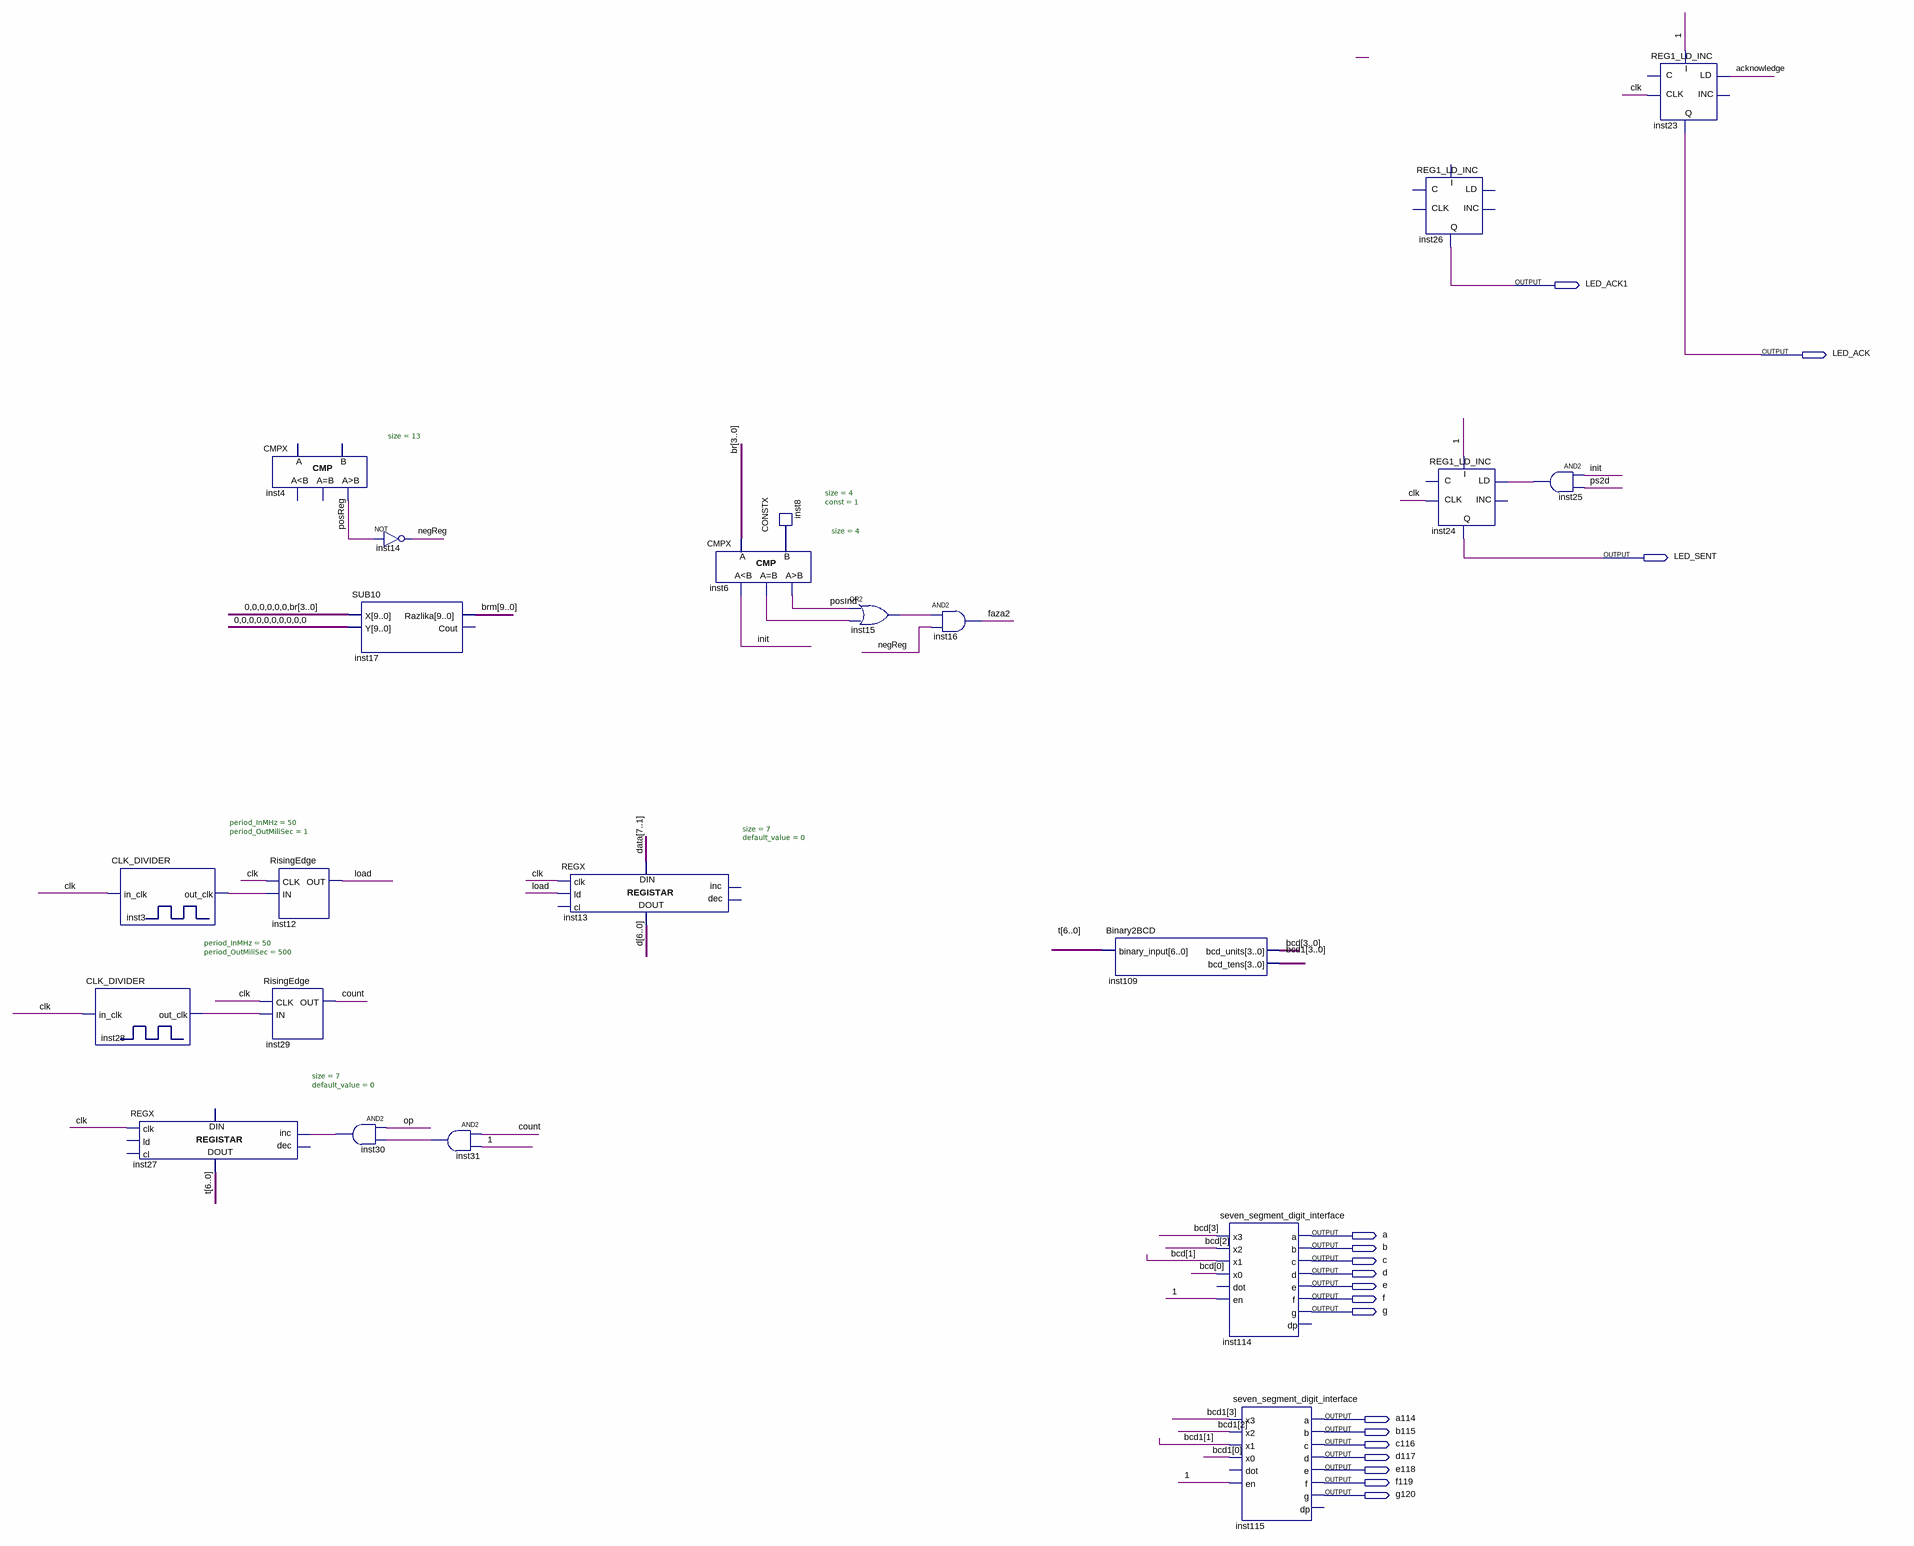
[diagram p0: schematic sheet]
// Quartus schematic MouseSetup - Copy.bdf as structural Verilog: 22 symbols, 17 pins
module \MouseSetup_-_Copy  (
  output LED_ACK1,
  output LED_ACK,
  output LED_SENT,
  output a,
  output b,
  output c,
  output d,
  output e,
  output f,
  output g,
  output a114,
  output b115,
  output c116,
  output d117,
  output e118,
  output f119,
  output g120
);

  wire \0 , \1 , acknowledge, clk, count, faza2, init, inst3_out_clk, inst6_eq, inst15_out, inst25_out,
       inst28_out_clk, inst30_out, inst31_out, load, negReg, op, posInd, posReg, ps2d;
  wire [3:0] bcd, bcd1, br, inst8_data;
  wire [6:0] d_bus, t;
  wire [7:1] data;
  wire [9:0] brm;

  CLK_DIVIDER #(.period_InMHz(50), .period_OutMiliSec(1)) inst3 (.in_clk(clk), .out_clk(inst3_out_clk));
  CLK_DIVIDER #(.period_InMHz(50), .period_OutMiliSec(500)) inst28 (.in_clk(clk), .out_clk(inst28_out_clk));
  REGX #(.size(7), .default_value(0)) inst27 (.clk(clk), .inc(inst30_out), .data_out(t));  // open: ld, cl, dec, data_in
  CMPX #(.size(13)) inst4 (.gr(posReg));  // open: A, B, ls, eq
  RisingEdge inst29 (.CLK(clk), .IN(inst28_out_clk), .OUT(count));
  RisingEdge inst12 (.CLK(clk), .IN(inst3_out_clk), .OUT(load));
  SUB10 inst17 (.X({{6{\0 }}, br}), .Y({10{\0 }}), .Razlika(brm));  // open: Cout
  and inst30 (inst30_out, op, inst31_out);
  not inst14 (negReg, posReg);
  and inst31 (inst31_out, count, \1 );
  REGX #(.size(7), .default_value(0)) inst13 (
    .clk(clk), .ld(load), .data_in(data), .data_out(d_bus));  // open: cl, inc, dec
  CMPX #(.size(4)) inst6 (.A(br), .B(inst8_data), .ls(init), .eq(inst6_eq), .gr(posInd));
  CONSTX #(.size(4), .\const (1)) inst8 (.data(inst8_data));
  or inst15 (inst15_out, posInd, inst6_eq);
  and inst16 (faza2, inst15_out, negReg);
  Binary2BCD inst109 (.binary_input(t), .bcd_units(bcd), .bcd_tens(bcd1));
  seven_segment_digit_interface inst114 (
    .x3(bcd[3]), .x2(bcd[2]), .x1(bcd[1]), .x0(bcd[0]), .en(\1 ), .a(a), .b(b), .c(c), .d(d), .e(e), .f(f),
    .g(g));  // open: dot, dp
  seven_segment_digit_interface inst115 (
    .x3(bcd1[3]), .x2(bcd1[2]), .x1(bcd1[1]), .x0(bcd1[0]), .en(\1 ), .a(a114), .b(b115), .c(c116), .d(d117),
    .e(e118), .f(f119), .g(g120));  // open: dot, dp
  REG1_LD_INC inst26 (.Q(LED_ACK1));  // open: I, LD, INC, CLK, C
  REG1_LD_INC inst24 (.I(\1 ), .LD(inst25_out), .CLK(clk), .Q(LED_SENT));  // open: INC, C
  and inst25 (inst25_out, init, ps2d);
  REG1_LD_INC inst23 (.I(\1 ), .LD(acknowledge), .CLK(clk), .Q(LED_ACK));  // open: INC, C
endmodule
